# EAGLE design KwadraLampaBT (EAGLE 6.1)
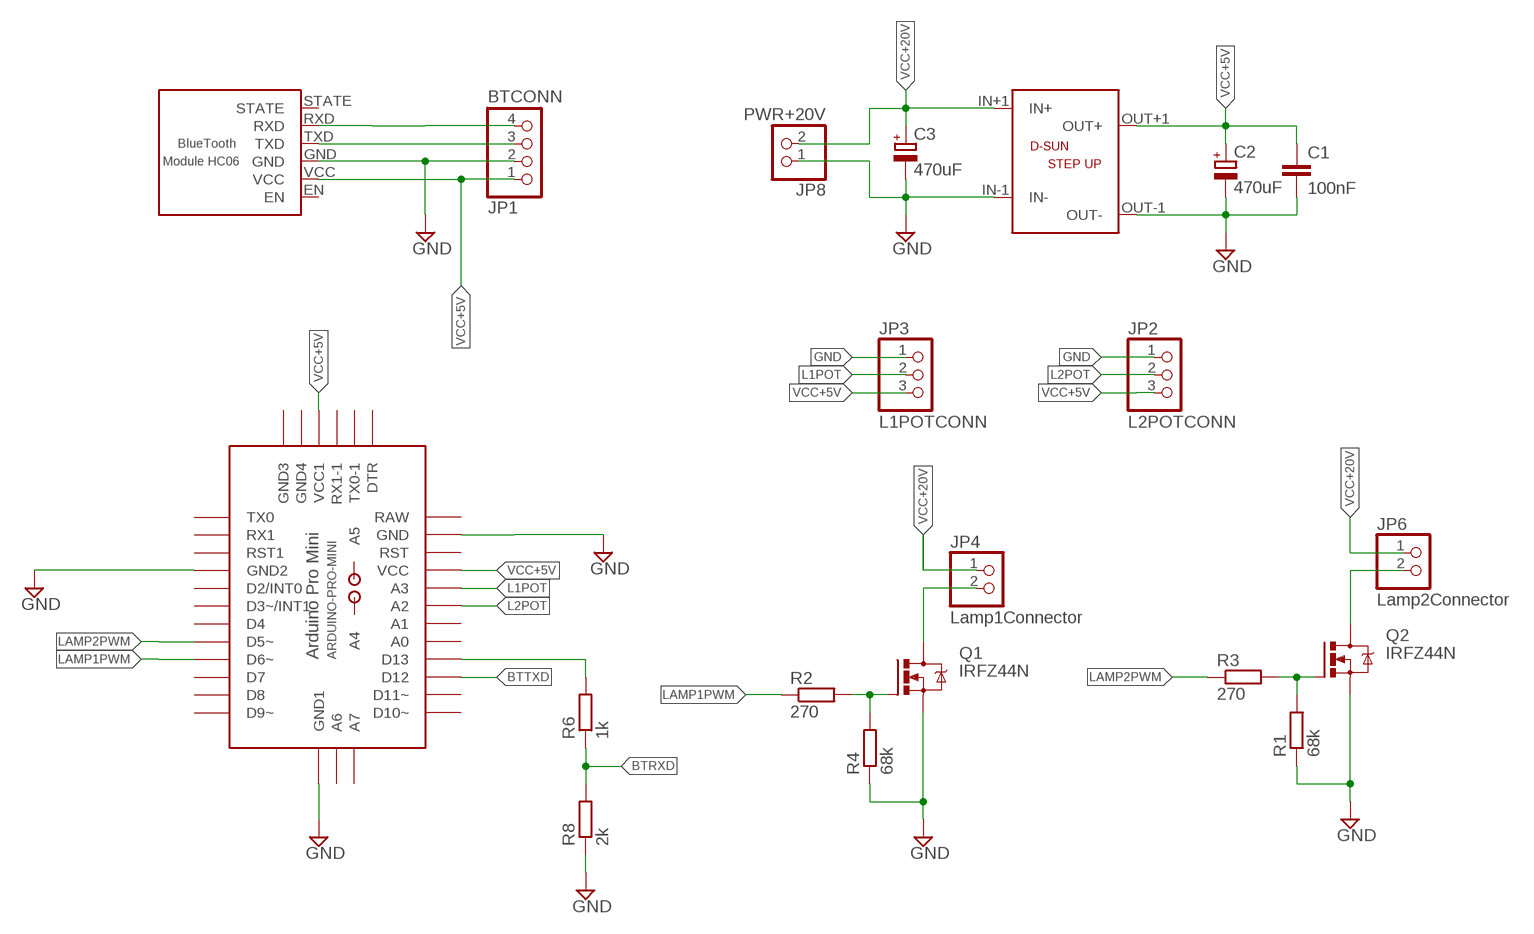
[diagram p0: schematic, sheet 1]

## Parts
C1  100nF  C_CERAMIC_2.5X50  [C025-025X050]
C2  470uF  C_ELECTROLYTIC_3  [C_E_R5-FI13_ELECTROLYTIC]
C3  470uF  C_ELECTROLYTIC_3  [C_E_R5-FI13_ELECTROLYTIC]
IC1  HC06  [HC06]
JP1  BTCONN  PINHD-1X4  [1X04]
JP2  L2POTCONN  PINHD-1X3  [1X03]
JP3  L1POTCONN  PINHD-1X3  [1X03]
JP4  Lamp1Connector  PINHD-1X2  [1X02]
JP6  Lamp2Connector  PINHD-1X2  [1X02]
JP8  PWR+20V  PINHD-1X2  [1X02]
Q1  IRFZ44N  IRFZ44NVERT  [TO220AB-GDS-VERT]
Q2  IRFZ44N  IRFZ44NVERT  [TO220AB-GDS-VERT]
R1  68k  R_SMD1206  [SMD1206]
R2  270  R_SMD1206  [SMD1206]
R3  270  R_SMD1206  [SMD1206]
R4  68k  R_SMD1206  [SMD1206]
R6  1k  R_SMD1206  [SMD1206]
R8  2k  R_SMD1206  [SMD1206]
U$1  ARDUINO-PRO-MINI  [ARDUINO-PRO-MINI]
U$2  STEPUP_D-SUN  [STEPUP_D-SUN]

## Nets
ARDTXD: R6.2 U$1.D13
BTRXD: IC1.RXD JP1.4 R6.1 R8.2
BTTXD: IC1.TXD JP1.3 U$1.D12
GND: C1.2 C2.- C3.- IC1.GND JP1.2 JP2.1 JP3.1 JP8.1 Q1.S Q2.S R1.1 R4.1 R8.1 U$1.GND U$1.GND1 U$1.GND2 U$2.IN-1(IN-) U$2.OUT-1(OUT-)
L1POT: JP3.2 U$1.A3
L2POT: JP2.2 U$1.A2
LAMP1PWM: R2.1 U$1.D6(D6~)
LAMP2PWM: R3.1 U$1.D5(D5~)
N$1: JP4.2 Q1.D
N$2: JP6.2 Q2.D
N$3: Q2.G R1.2 R3.2
N$4: Q1.G R2.2 R4.2
VCC+5V: C1.1 C2.+ IC1.VCC JP1.1 JP2.3 JP3.3 U$1.VCC U$1.VCC1 U$2.OUT+1(OUT+)
VCC+20V: C3.+ JP4.1 JP6.1 JP8.2 U$2.IN+1(IN+)
Unconnected: IC1.EN IC1.STATE U$1.A0 U$1.A1 U$1.A4 U$1.A5 U$1.A6 U$1.A7 U$1.D2(D2/INT0) U$1.D3(D3~/INT1) U$1.D4 U$1.D7 U$1.D8 U$1.D9(D9~) U$1.D10(D10~) U$1.D11(D11~) U$1.DTR U$1.GND3 U$1.GND4 U$1.RAWVOLTAGE(RAW) U$1.RST U$1.RST1 U$1.RX1 U$1.RX1-1 U$1.TX0 U$1.TX0-1

## Library data of the parts
C1 = 00 My RLC:C_CERAMIC_
C2 C3 = 00 My RLC:C_ELECTROLYTIC_
IC1 = 00 MyModules:HC06
JP1 = 00 My Pinheaders:PINHD-1X4: PIN HEADER
JP2 JP3 = 00 My Pinheaders:PINHD-1X3: PIN HEADER
JP4 JP6 JP8 = 00 My Pinheaders:PINHD-1X2: PIN HEADER
Q1 Q2 = 00 My Transistors:IRFZ44N: IRFZ44N HEXFET® Power MOSFET VDSS = 55V RDS(on) = 17.5mW ID = 49A VGS(th) Gate Threshold Voltage 2.0 ––– 4.0 V VDS = VGS, ID = 250μA
R1-R4 R6 R8 = 00 My RLC:R_
U$1 = 00 Arduino-clone:ARDUINO-PRO-MINI: Arduino Pro-Mini Arduino Clone by KubaMiszcz 2016
U$2 = 00 MyModules:STEPUP_D-SUN

## Board
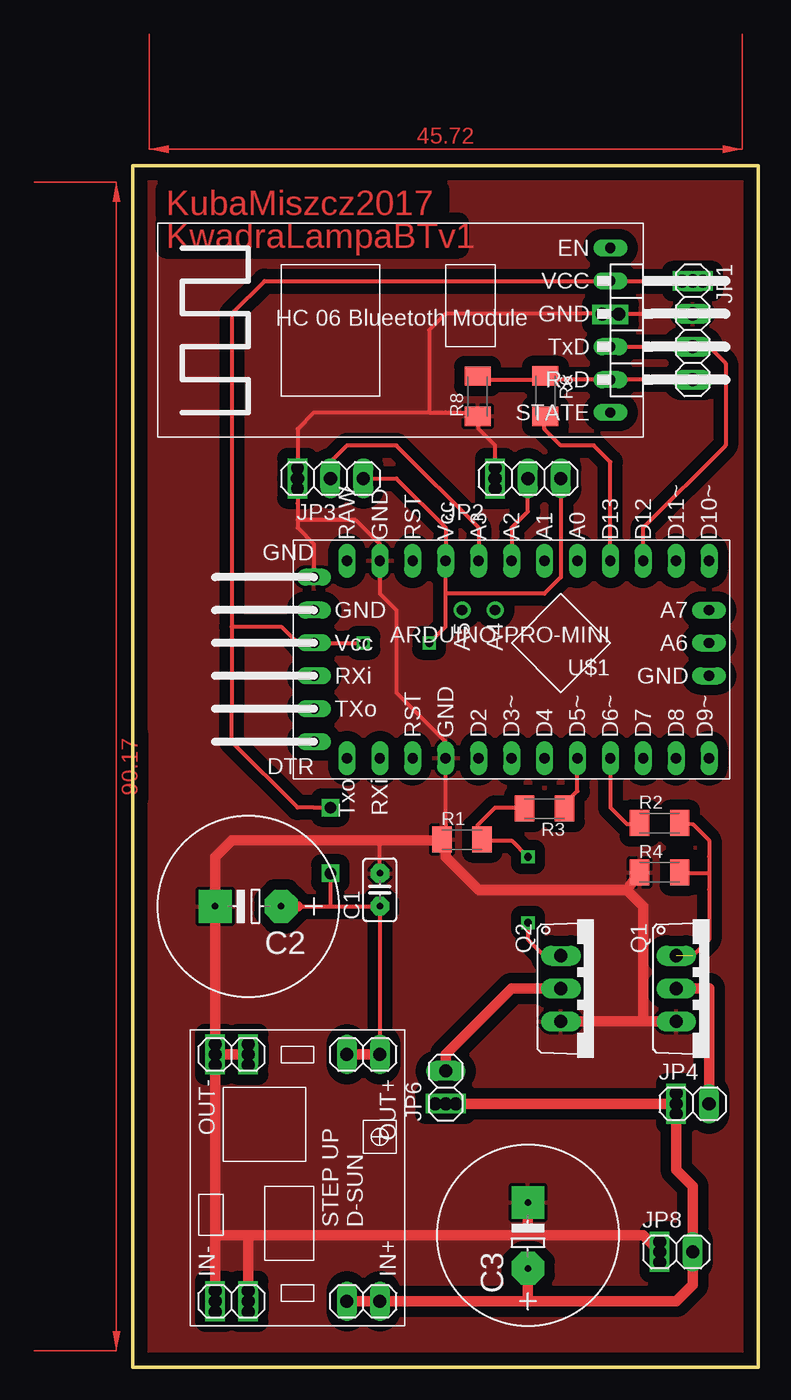
[diagram p1: board, top side]
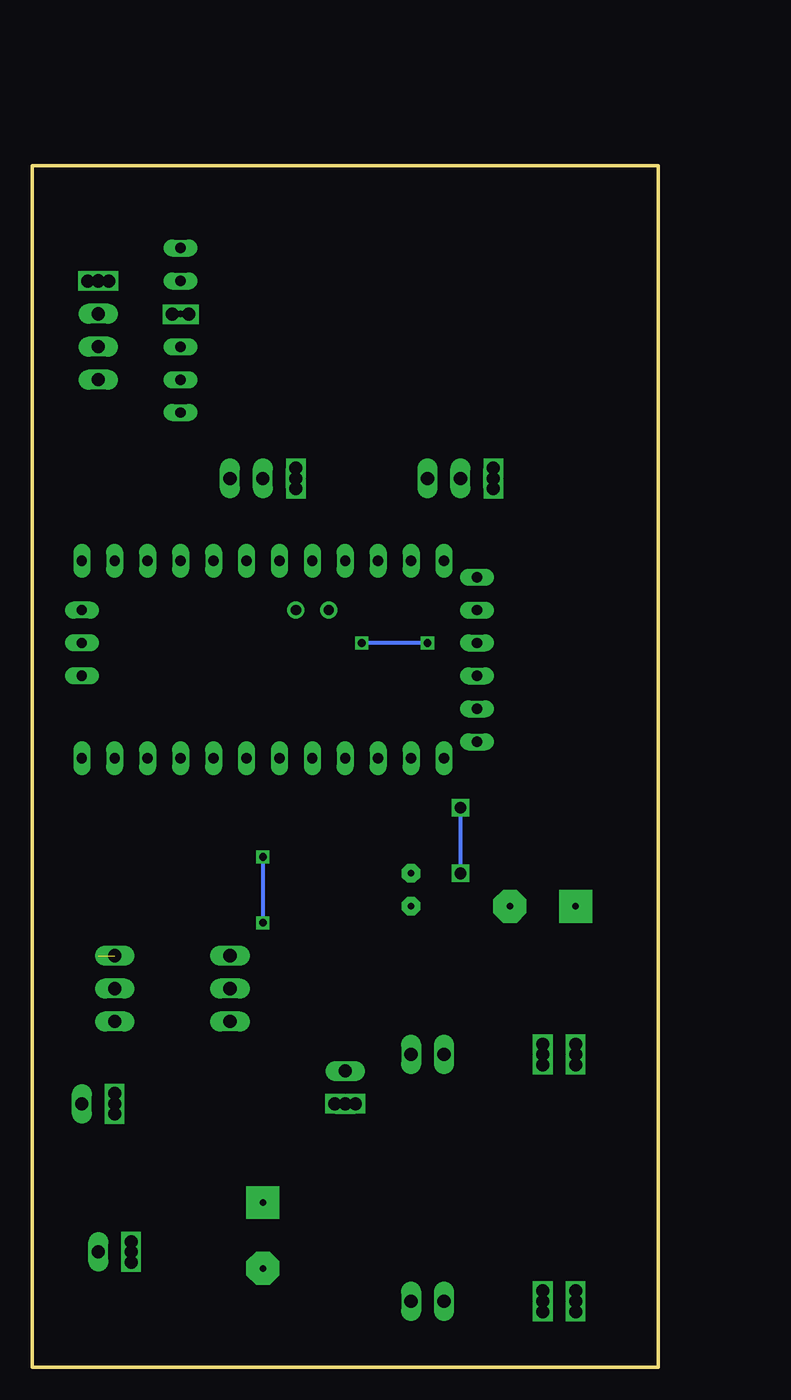
[diagram p2: board, bottom side, seen from below]

Size 48.26 x 92.71 mm. Coordinates in mm from the lower left corner, seen from the top.
Outline: 0,92.71 48.26,92.71 48.26,0 0,0 0,92.71
Copper layers (1*16): Top 0.035mm / dielectric 1.5mm / Bottom 0.035mm
Design rules: minimum track width 10mil, minimum drill 24mil, track to track 8mil, track to pad 8mil, pad to pad 8mil, via to via 8mil, smd to smd 8mil, copper to edge 40mil, drill to drill 8mil, minimum pad ring 10mil, minimum via ring 8mil, stop-mask expansion 4mil, vias tented up to drill 0mil, thermal gap 10mil

### Footprints (pad centres in the part's own frame; a part is rotated, then mirrored left to right if it is on the bottom)
C025-025X050 = drill 0.5 pad 1.422 octagon: 1 -1.27,0; 2 1.27,0
C_E_R5-FI13_ELECTROLYTIC = drill 0.5 pad 2.54 octagon: + -2.54,0 | drill 0.5 pad 2.54 square: - 2.54,0
HC06 = drill 0.8 long: EN -12.7,-5.08; RXD -12.7,5.08; STATE -12.7,7.62; TXD -12.7,2.54; VCC -12.7,-2.54 | drill 0.5 pad 1.27 long: GND -12.7,0 | drill 1 square: P$4 -13.335,0.032; P$5 -13.335,0.032; P$6 -12.065,0.032
1X04 = drill 1.016 long: 1 -3.81,0; 2 -1.27,0; 3 1.27,0; 4 3.81,0 | drill 1 square: P$1 -3.81,0.794; P$2 -3.81,-0.794 | drill 1 long: P$3 -3.81,0
1X03 = drill 1.016 long: 1 -2.54,0; 2 0,0; 3 2.54,0 | drill 1 square: P$1 -2.54,0.794; P$2 -2.54,-0.794 | drill 1 long: P$3 -2.54,0
1X02 = drill 1.016 long: 1 -1.27,0; 2 1.27,0 | drill 1 square: P$1 -1.27,0.794; P$2 -1.27,-0.794 | drill 1 long: P$3 -1.27,0
TO220AB-GDS-VERT = drill 1.016 long: D 0,0; G -2.54,0; S 2.54,0
SMD1206 = smd 1.5 x 2: 1 -1.554,0.077; 2 1.546,0.077
ARDUINO-PRO-MINI = drill 0.8 long: A0 7.62,-1.27; A1 7.62,1.27; A2 7.62,3.81; A3 7.62,6.35; A6 1.27,-11.43; A7 3.81,-11.43; D2 -7.62,6.35; D3 -7.62,3.81; D4 -7.62,1.27; D5 -7.62,-1.27; D6 -7.62,-3.81; D7 -7.62,-6.35; D8 -7.62,-8.89; D9 -7.62,-11.43; D10 7.62,-11.43; D11 7.62,-8.89; D12 7.62,-6.35; D13 7.62,-3.81; DTR -6.35,19.05; GND 7.62,13.97; GND1 -7.62,8.89; GND2 6.35,19.05; GND3 3.81,19.05; GND4 -1.27,-11.43; RAWVOLTAGE 7.62,16.51; RST 7.62,11.43; RST1 -7.62,11.43; RX1 -7.62,13.97; RX1-1 -1.27,19.05; TX0 -7.62,16.51; TX0-1 -3.81,19.05; VCC 7.62,8.89; VCC1 1.27,19.05 | drill 0.8: A4 3.81,5.08; A5 3.81,7.62
STEPUP_D-SUN = drill 1.016 long: 1 -10.16,3.81; 4 8.89,3.81; IN+1 -10.16,-3.81; IN+2 -10.16,-6.35; OUT+1 8.89,-3.81; OUT+2 8.89,-6.35 | drill 1 long: IN-1 -10.16,6.35; IN-2 -10.16,3.81; OUT-1 8.89,6.35; OUT-2 8.89,3.81 | drill 1 square: P$1 -10.954,3.81; P$2 -9.366,3.81; P$4 8.096,3.81; P$5 9.684,3.81; P$7 -10.954,6.35; P$8 -9.366,6.35; P$10 8.096,6.35; P$11 9.684,6.35

### Placement (x,y rotation side)
C1  19.05,36.83 90 top
C2  8.89,35.56 180 top
C3  30.48,10.16 90 top
IC1  24.13,81.28 180 top
JP1  43.18,80.01 270 top
JP2  30.48,68.58 0 top
JP3  15.24,68.58 0 top
JP4  43.18,20.32 0 top
JP6  24.13,21.59 90 top
JP8  41.91,8.89 0 top
Q1  41.91,29.21 270 top
Q2  33.02,29.21 270 top
R1  25.4,40.64 0 top
R2  40.64,41.91 0 top
R3  31.75,43.18 180 top
R4  40.64,38.1 0 top
R6  31.75,74.93 270 top
R8  26.67,74.93 90 top
U$1  33.02,54.61 90 top
U$2  12.7,15.24 90 top

### Tracks (layer width: path | path; a pad name or v marks a point on that pad's centre or on a via)
ARDTXD
  Top 0.305: U$1.D13 36.83,69.85 35.56,71.12 33.02,71.12 31.75,72.39 31.75,73.31 R6.2
BTRXD
  Top 0.305: JP1.4 IC1.RXD 32.11,76.2 R6.1 31.54,76.2 26.67,76.2 26.59,76.28 R8.2
BTTXD
  Top 0.305: U$1.D12 39.37,64.77 45.72,71.12 45.72,77.47 44.45,78.74 JP1.3 IC1.TXD
GND
  Top 0.305: JP1.2 IC1.GND 24.13,81.28 22.86,80.01 22.86,73.66 | 12.7,65.4 12.7,66.67 12.7,67.31 JP3.1 12.7,72.39 13.97,73.66 22.86,73.66 | 12.7,65.4 17.15,65.4 17.78,64.77 19.05,63.5 U$1.GND 19.05,59.69 20.32,58.42 20.32,52.07 24.13,48.26 U$1.GND1 24.13,41.91 24.13,41 R1.1 23.77,40.64 | C1.2 19.05,40.64 | 12.7,65.4 12.7,64.77 13.97,63.5 U$1.GND2 | 22.86,73.66 24.13,73.66 26.67,73.66 26.59,73.58 R8.1 26.67,73.3 26.67,72.39 27.94,71.12 JP2.1
  Top 0.406: U$2.OUT-1 8.89,24.13 | R1.1 24.21,40.72 24.13,40.64
  Top 0.813: U$2.OUT-1 6.35,10.16 | 6.35,10.16 U$2.IN-1 6.35,10.16 | 8.89,10.16 6.35,10.16 | 8.89,10.16 8.89,5.08 | JP8.1 39.37,10.16 30.48,10.16 | 30.48,10.16 C3.- 30.48,10.16 | 30.48,10.16 8.89,10.16 | U$2.OUT-1 8.89,24.13 | Q2.S 38.1,26.67 39.37,26.67 | 39.37,26.67 40.64,26.67 Q1.S | 39.37,26.67 39.37,35.56 38.1,36.83 | 38.1,36.83 R4.1 | U$2.OUT-1 C2.- 6.35,39.37 7.62,40.64 19.05,40.64 23.77,40.64 R1.1 24.13,40.43 24.13,39.37 26.67,36.83 31.75,36.83 35.56,36.83 38.1,36.83
  pour Top (isolate 0.813): 0,92.71 0,0 48.26,0 48.26,92.71
L1POT
  Top 0.305: JP3.2 15.24,69.85 16.51,71.12 19.05,71.12 20.32,71.12 26.67,64.77 U$1.A3
L2POT
  Top 0.305: JP2.2 30.48,66.04 29.21,64.77 U$1.A2
LAMP1PWM
  Top 0.305: U$1.D6 36.83,43.18 38.1,41.91 39.37,41.91 39.29,41.99 R2.1
LAMP2PWM
  Top 0.305: 33.3,43.46 34.29,44.45 U$1.D5
  Top 0.406: R3.1 33.3,43.46
N$1
  Top 0.813: Q1.D 44.45,29.21 44.45,22.86 JP4.2
N$2
  Top 0.813: Q2.D 30.48,29.21 29.21,29.21 24.13,24.13 JP6.2
N$3  (via drill 0.6)
  Top 0.305: R1.2 26.59,40.72 | 26.59,40.72 26.67,40.64 29.21,40.64 v30.48,39.37 | R3.2 30.28,43.18 30.48,43.18 29.21,43.18 27.94,43.18 26.67,41.91 26.59,41.83 26.59,40.72 | v30.48,34.29 30.48,33.02 31.75,31.75 Q2.G
  Bottom 0.305: v30.48,39.37 v30.48,34.29
N$4  (1 unrouted)
  Top 0.305: R2.2 43.18,41.91 44.45,40.64 44.45,39.37 | 43.18,31.75 44.45,33.02 44.45,36.83 44.45,38.1 | 44.45,39.37 44.45,38.1 | 44.45,39.37 44.45,38.1 | 44.45,38.1 43.18,38.1 42.26,38.1 R4.2
VCC+5V  (via drill 0.6, 0.9)
  Top 0.305: JP1.1 IC1.VCC 10.16,83.82 7.62,81.28 7.62,57.15 | JP3.3 20.32,68.58 24.13,64.77 U$1.VCC 24.13,59.69 | 7.62,57.15 8.89,57.15 11.43,57.15 12.7,55.88 U$1.VCC1 16.51,55.88 v17.78,55.88 | 12.7,35.56 15.24,35.56 | 15.24,35.56 C1.1 19.05,24.13 | 7.62,57.15 7.62,50.8 7.62,48.26 12.7,43.18 13.97,43.18 v15.24,43.18 | v15.24,38.1 15.24,35.56 | 24.13,59.69 24.13,57.15 v22.86,55.88 | JP2.3 33.02,60.96 31.75,59.69 24.13,59.69
  Top 0.813: U$2.OUT+1 19.05,24.13 | C2.+ 12.7,35.56
  Bottom 0.305: v15.24,43.18 v15.24,38.1 | v17.78,55.88 v22.86,55.88
VCC+20V
  Top 0.813: 30.48,5.08 20.32,5.08 19.05,5.08 U$2.IN+1 | 30.48,5.08 41.91,5.08 43.18,6.35 JP8.2 43.18,13.97 41.91,15.24 JP4.1 JP6.1 | C3.+ 30.48,5.08
(copper drawn outside any net)
  shapes: Top area x2

### Text on the board
Top: KubaMiszcz2017 | KwadraLampaBTv1